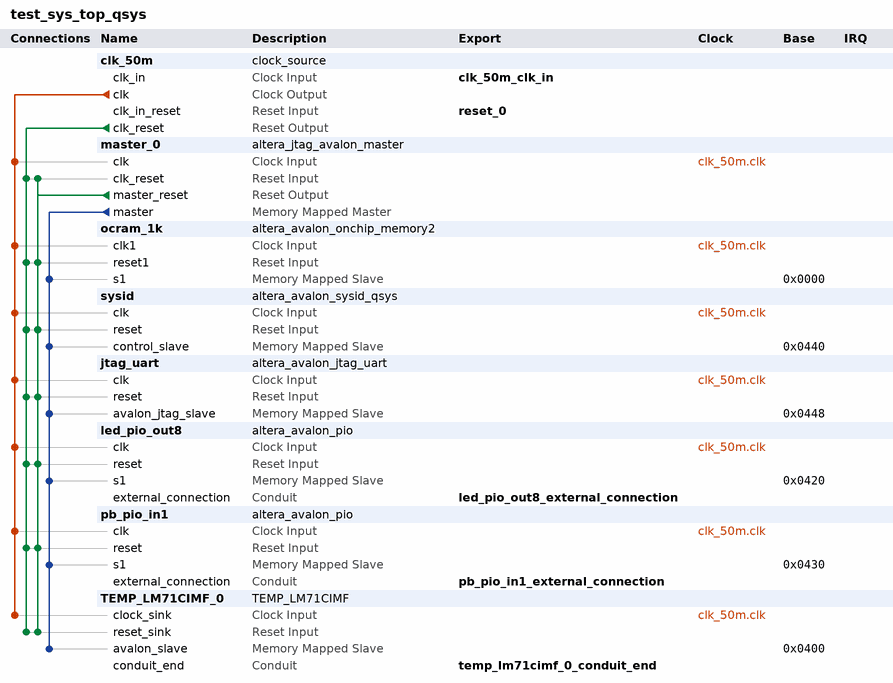
[diagram p0: system contents]
# Platform Designer (Qsys) system test_sys_top_qsys, MAX 10 10M50DAF484C6GES
# Parameters at their usual value, and those the tool derives, are not listed.
package require -exact qsys 15.0
create_system test_sys_top_qsys
set_project_property DEVICE_FAMILY {MAX 10}
set_project_property DEVICE 10M50DAF484C6GES

add_instance clk_50m clock_source 15.0
set_instance_parameter_value clk_50m clockFrequency 50000000

add_instance master_0 altera_jtag_avalon_master 15.0

add_instance ocram_1k altera_avalon_onchip_memory2 15.0
set_instance_parameter_value ocram_1k dataWidth 32
set_instance_parameter_value ocram_1k dualPort false
set_instance_parameter_value ocram_1k initMemContent false
set_instance_parameter_value ocram_1k initializationFileName ocram_1k
set_instance_parameter_value ocram_1k memorySize 1024

add_instance sysid altera_avalon_sysid_qsys 15.0
set_instance_parameter_value sysid id -889266486

add_instance jtag_uart altera_avalon_jtag_uart 15.0
set_instance_parameter_value jtag_uart simInteractiveOptions INTERACTIVE_ASCII_OUTPUT

add_instance led_pio_out8 altera_avalon_pio 15.0
set_instance_parameter_value led_pio_out8 direction Output
set_instance_parameter_value led_pio_out8 width 8

add_instance pb_pio_in1 altera_avalon_pio 15.0
set_instance_parameter_value pb_pio_in1 direction Input
set_instance_parameter_value pb_pio_in1 width 1

add_instance TEMP_LM71CIMF_0 TEMP_LM71CIMF 1.0

# connections
add_connection clk_50m.clk jtag_uart.clk clock
add_connection clk_50m.clk led_pio_out8.clk clock
add_connection clk_50m.clk master_0.clk clock
add_connection clk_50m.clk ocram_1k.clk1 clock
add_connection clk_50m.clk pb_pio_in1.clk clock
add_connection clk_50m.clk sysid.clk clock
add_connection clk_50m.clk TEMP_LM71CIMF_0.clock_sink clock
add_connection clk_50m.clk_reset jtag_uart.reset reset
add_connection clk_50m.clk_reset led_pio_out8.reset reset
add_connection clk_50m.clk_reset master_0.clk_reset reset
add_connection clk_50m.clk_reset ocram_1k.reset1 reset
add_connection clk_50m.clk_reset pb_pio_in1.reset reset
add_connection clk_50m.clk_reset sysid.reset reset
add_connection clk_50m.clk_reset TEMP_LM71CIMF_0.reset_sink reset
add_connection master_0.master_reset jtag_uart.reset reset
add_connection master_0.master_reset led_pio_out8.reset reset
add_connection master_0.master_reset master_0.clk_reset reset
add_connection master_0.master_reset ocram_1k.reset1 reset
add_connection master_0.master_reset pb_pio_in1.reset reset
add_connection master_0.master_reset sysid.reset reset
add_connection master_0.master_reset TEMP_LM71CIMF_0.reset_sink reset
add_connection master_0.master jtag_uart.avalon_jtag_slave avalon
set_connection_parameter_value master_0.master/jtag_uart.avalon_jtag_slave baseAddress 0x0448
add_connection master_0.master led_pio_out8.s1 avalon
set_connection_parameter_value master_0.master/led_pio_out8.s1 baseAddress 0x0420
add_connection master_0.master ocram_1k.s1 avalon
set_connection_parameter_value master_0.master/ocram_1k.s1 baseAddress 0x0000
add_connection master_0.master pb_pio_in1.s1 avalon
set_connection_parameter_value master_0.master/pb_pio_in1.s1 baseAddress 0x0430
add_connection master_0.master sysid.control_slave avalon
set_connection_parameter_value master_0.master/sysid.control_slave baseAddress 0x0440
add_connection master_0.master TEMP_LM71CIMF_0.avalon_slave avalon
set_connection_parameter_value master_0.master/TEMP_LM71CIMF_0.avalon_slave baseAddress 0x0400

# exported interfaces
add_interface clk_50m_clk_in clock sink
set_interface_property clk_50m_clk_in EXPORT_OF clk_50m.clk_in
add_interface led_pio_out8_external_connection conduit end
set_interface_property led_pio_out8_external_connection EXPORT_OF led_pio_out8.external_connection
add_interface pb_pio_in1_external_connection conduit end
set_interface_property pb_pio_in1_external_connection EXPORT_OF pb_pio_in1.external_connection
add_interface reset_0 reset sink
set_interface_property reset_0 EXPORT_OF clk_50m.clk_in_reset
add_interface temp_lm71cimf_0_conduit_end conduit end
set_interface_property temp_lm71cimf_0_conduit_end EXPORT_OF TEMP_LM71CIMF_0.conduit_end

set_interconnect_requirement {$system} qsys_mm.clockCrossingAdapter HANDSHAKE
set_interconnect_requirement {$system} qsys_mm.maxAdditionalLatency 1

save_system test_sys_top_qsys.qsys
